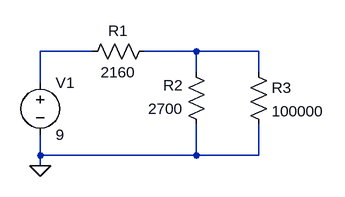
[diagram p0: schematic Lab1_2A_5_100000.asc]
Lab1_2A_5_100000.asc, the LTspice schematic file:
Version 4
SHEET 1 880 680
WIRE 128 96 48 96
WIRE 288 96 208 96
WIRE 384 96 288 96
WIRE 288 128 288 96
WIRE 384 128 384 96
WIRE 48 144 48 96
WIRE 48 256 48 224
WIRE 288 256 288 208
WIRE 288 256 48 256
WIRE 384 256 384 208
WIRE 384 256 288 256
WIRE 48 272 48 256
FLAG 48 272 0
SYMBOL voltage 48 128 R0
WINDOW 123 0 0 Left 0
WINDOW 39 0 0 Left 0
SYMATTR InstName V1
SYMATTR Value 9
SYMBOL Res 112 112 R270
WINDOW 0 32 56 VTop 2
WINDOW 3 0 56 VBottom 2
SYMATTR InstName R1
SYMATTR Value 2160
SYMBOL Res 304 224 R180
WINDOW 0 36 76 Left 2
WINDOW 3 36 40 Left 2
SYMATTR InstName R2
SYMATTR Value 2700
SYMBOL Res 368 112 R0
SYMATTR InstName R3
SYMATTR Value 100000

The netlist it stands for:
* Lab1_2A_5_100000.asc
V1 N001 0 9
R1 N001 N002 2160
R2 0 N002 2700
R3 N002 0 100000
.backanno
.end